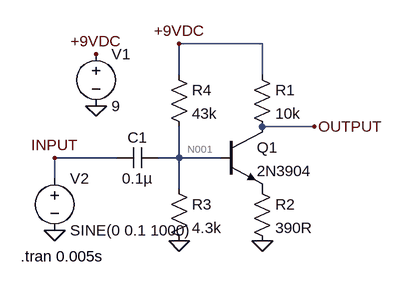
[diagram p0: schematic LPB1.asc]
LPB1.asc, the LTspice schematic file:
Version 4
SHEET 1 880 680
WIRE 208 0 80 0
WIRE 80 48 80 0
WIRE 208 48 208 0
WIRE 288 128 208 128
WIRE -16 176 -112 176
WIRE 80 176 80 128
WIRE 80 176 48 176
WIRE 144 176 80 176
WIRE -112 208 -112 176
WIRE 80 224 80 176
FLAG 80 304 0
FLAG 208 304 0
FLAG -48 96 0
FLAG -48 16 +9VDC
FLAG -112 288 0
FLAG 80 0 +9VDC
FLAG 288 128 OUTPUT
FLAG -112 176 INPUT
SYMBOL npn 144 128 R0
SYMATTR InstName Q1
SYMATTR Value 2N3904
SYMBOL res 192 32 R0
SYMATTR InstName R1
SYMATTR Value 10k
SYMBOL res 192 208 R0
SYMATTR InstName R2
SYMATTR Value 390R
SYMBOL res 64 208 R0
SYMATTR InstName R3
SYMATTR Value 4.3k
SYMBOL res 64 32 R0
SYMATTR InstName R4
SYMATTR Value 43k
SYMBOL cap 48 160 R90
WINDOW 0 0 32 VBottom 2
WINDOW 3 32 32 VTop 2
SYMATTR InstName C1
SYMATTR Value 0.1µ
SYMBOL voltage -48 0 R0
WINDOW 123 0 0 Left 0
WINDOW 39 0 0 Left 0
SYMATTR InstName V1
SYMATTR Value 9
SYMBOL voltage -112 192 R0
WINDOW 123 0 0 Left 0
WINDOW 39 0 0 Left 0
SYMATTR InstName V2
SYMATTR Value SINE(0 0.1 1000)
TEXT -164 328 Left 2 !.tran 0.005s

The netlist it stands for:
* LPB1.asc
Q1 OUTPUT N001 P001 0 2N3904
R1 +9VDC OUTPUT 10k
R2 P001 0 390R
R3 N001 0 4.3k
R4 +9VDC N001 43k
C1 N001 INPUT 0.1µ
V1 +9VDC 0 9
V2 INPUT 0 SINE(0 0.1 1000)
.model NPN NPN
.model PNP PNP
.lib standard.bjt
.tran 0.005s
.backanno
.end

* Results of the author's LTspice run, read from the files saved beside the schematic
* Operating Point, zero values left out:
*   V(output) = 4.439 V
*   V(n001) = 812.4 mV
*   V(p001) = 178.4 mV
*   V(+9vdc) = 9 V
*   Ic(Q1) = 456.1 µA
*   Ib(Q1) = 1.469 µA
*   Ie(Q1) = -457.6 µA
*   I(R4) = 190.4 µA
*   I(R3) = 188.9 µA
*   I(R2) = 457.6 µA
*   I(R1) = 456.1 µA
*   I(V1) = -646.5 µA
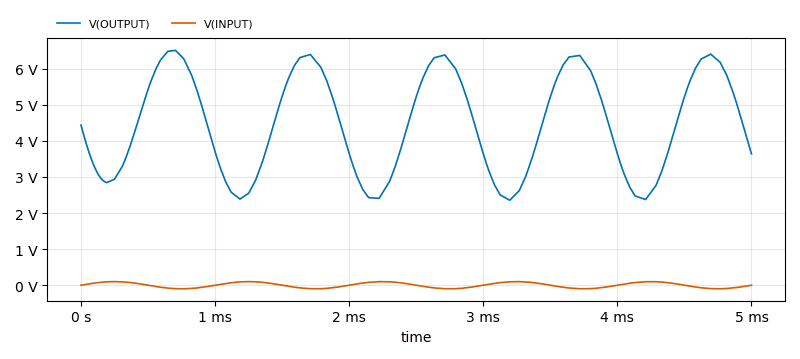
[diagram p1: Transient Analysis of LPB1.asc, plotted from the saved traces]
* Transient Analysis, 1 run:
*   V(OUTPUT): min 2.356 V, max 6.509 V, average 4.47 V, rms 4.684 V, last 3.643 V
*   V(INPUT): min -99.5 mV, max 100 mV, average 54.31 µV, rms 70.16 mV, last 0 V